# Altium project USRP2_Clone.PrjPcb (part 1 of 4)
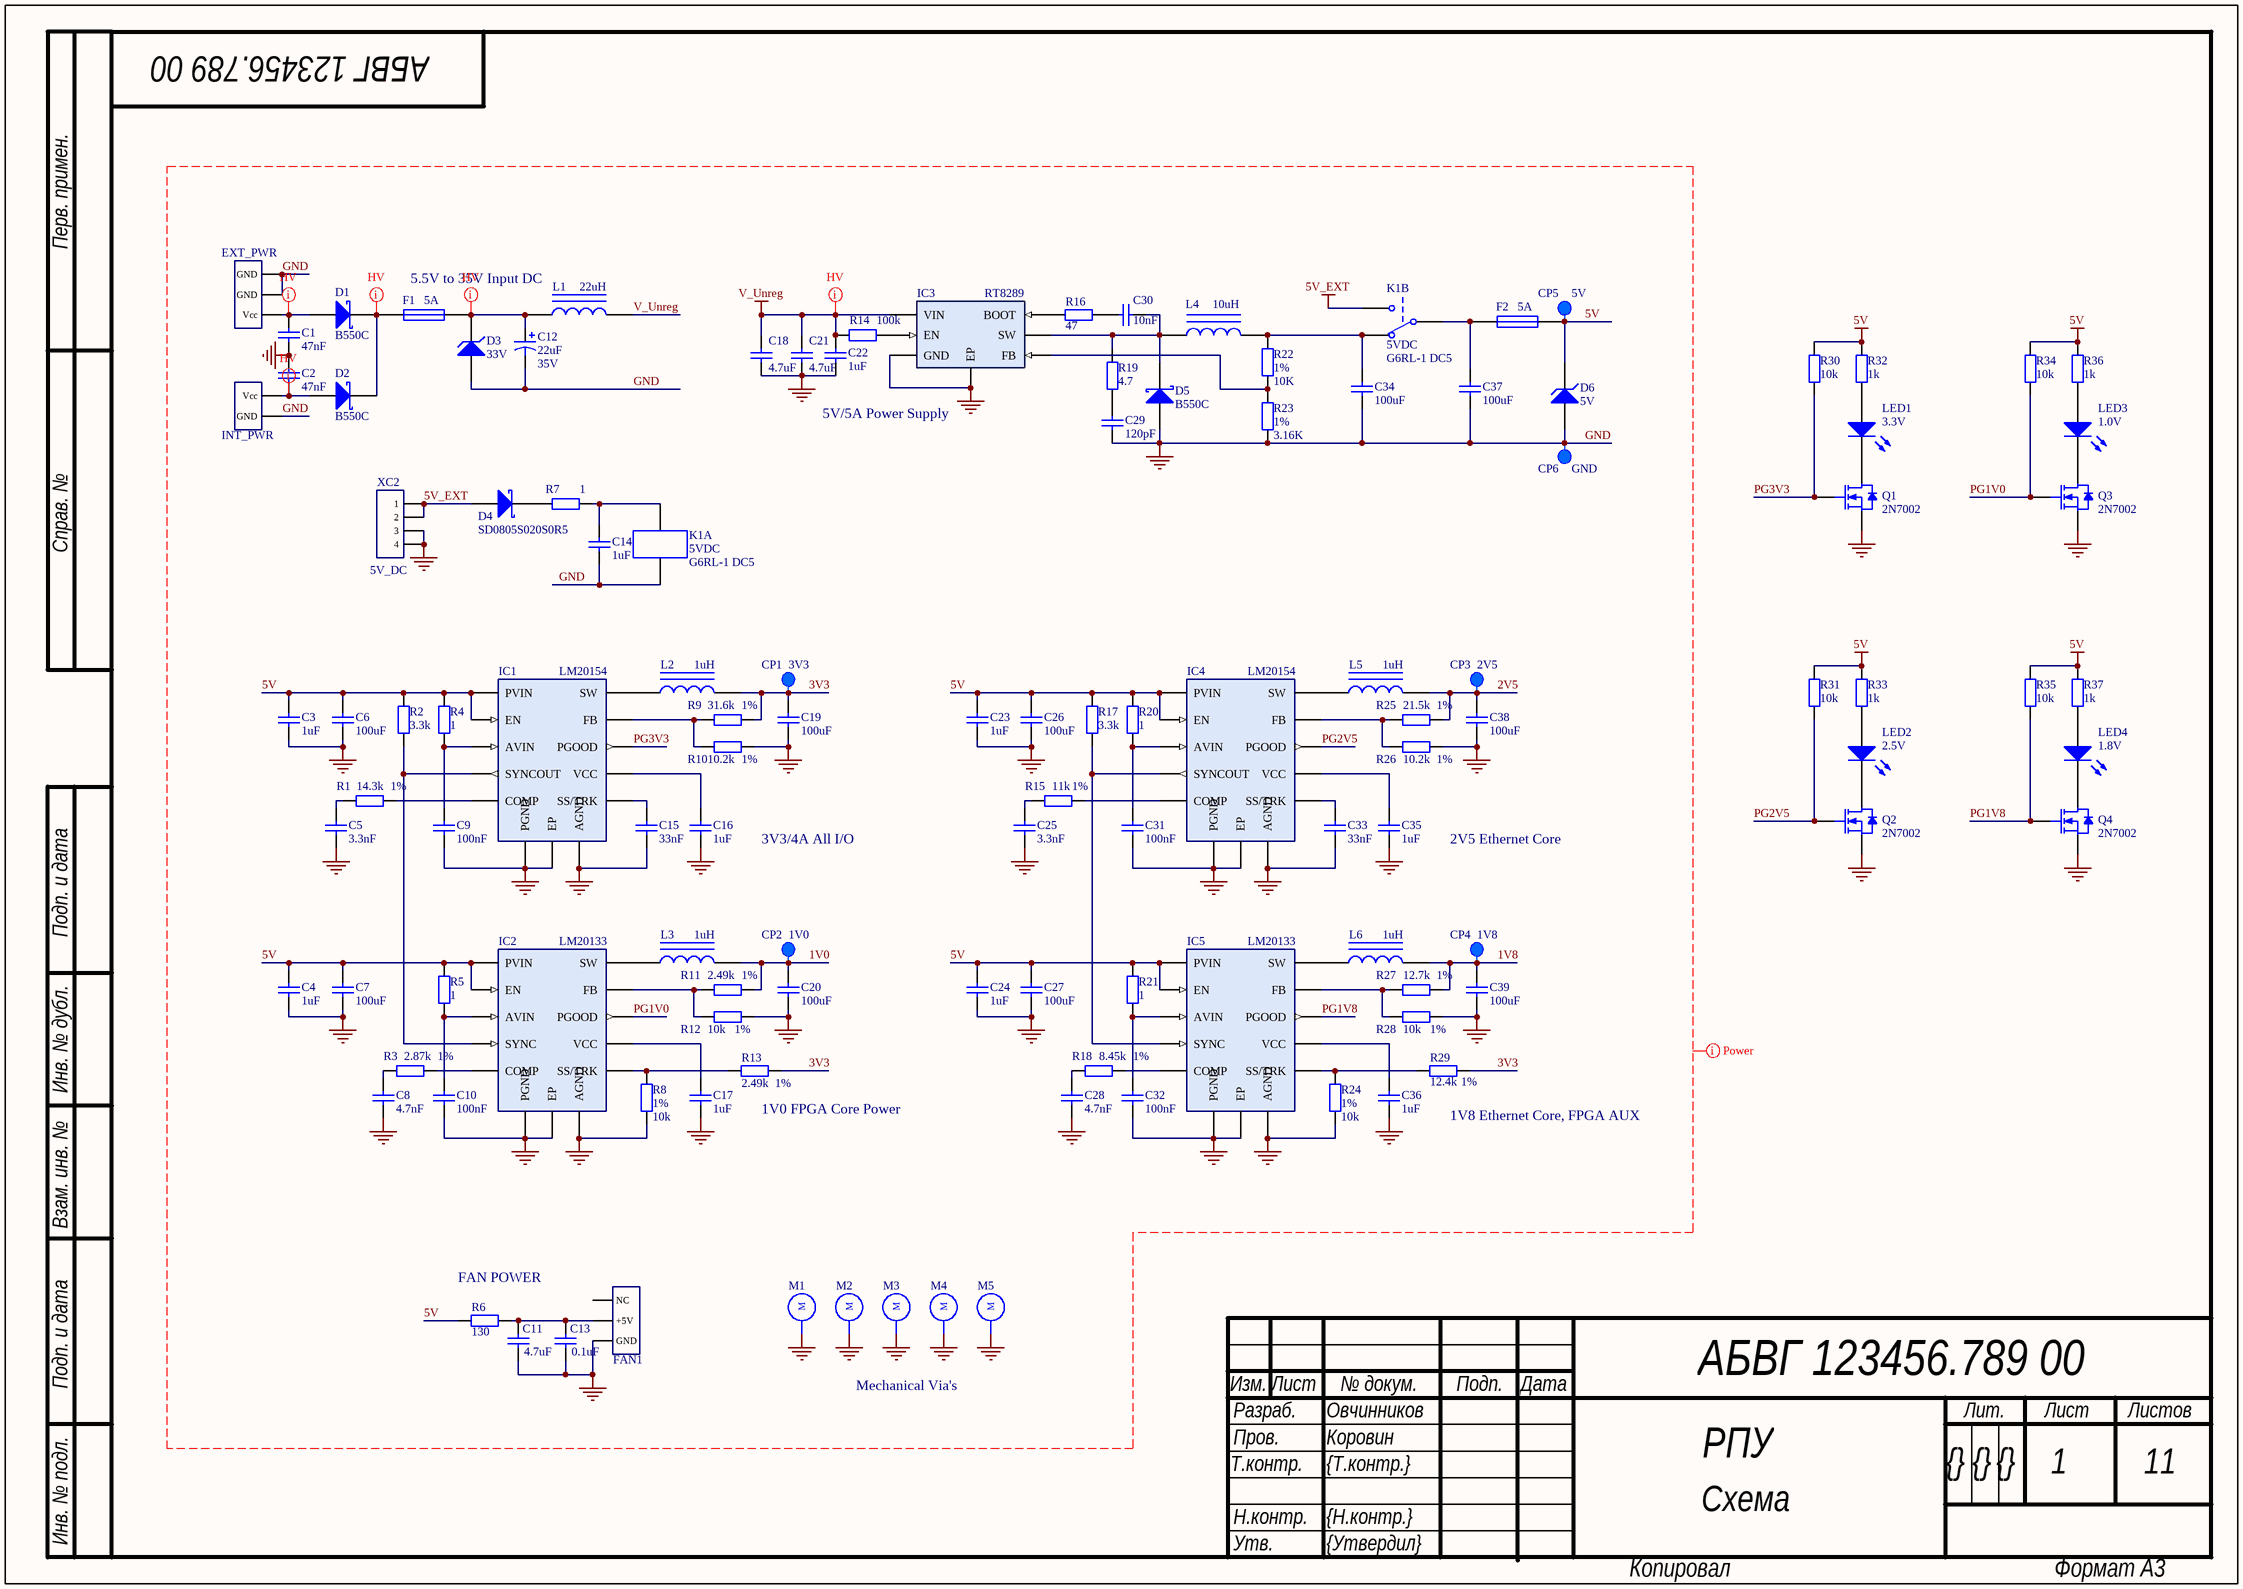
[diagram p0: Power_Supply.SchDoc]
11 sheets, 819 parts. Net scope: global (net labels, ports and power ports of the same name join across sheets).
Board file: MotherBoard.PcbDoc
Sheets:
  Power_Supply.SchDoc
  MGT_PWR.SchDoc
  FPGA_Power.SchDoc
  Ethernet.SchDoc
  JTAG.SchDoc
  Clocking.SchDoc
  DB.SchDoc
  FPGA&CODECS.SchDoc
  RAM&GPIO.SchDoc
  FSP+.SchDoc
  DDR2.SchDoc

## Sheet Power_Supply.SchDoc: РПУ
size 420 x 297 mm; ApprovedBy: {Утвердил}; CheckedBy: Коровин; DrawnBy: Овчинников; DocumentNumber: АБВГ 123456.789 00; SheetNumber: 1; SheetTotal: 11; Scale: {Мш.}; PageSetup: Record=PageOptions|CenterHorizontal=False|CenterVertical=False|PrintScale=0.95|XCorrection=0.00|YCorrection=0.00|PrintKind=1|BorderSize=5000000|LeftOffset=0|BottomOffset=0|Orientation=1|PaperLength=1000|PaperWidth=1000|Scale=100|PaperSource=15|PrintQuality=600|MediaType=1|DitherType=10|PaperKind=A4|PrintScaleMode=1; ProcessInspection: {Т.контр.}; Mass: {М.}; NormInspection: {Н.контр.}; Letter1Column: {}; Letter2Column: {}; Letter3Column: {}; DocumentType: Схема; Rule: PcbType=ProtelPcb

### Parts
C1  value 47nF  [C0805]  (hidden comment: Cap)
C2  value 47nF  [C0805]  (hidden comment: Cap)
C3  value 1uF  [C0805]  (hidden comment: Cap)
C4  value 1uF  [C0805]  (hidden comment: Cap)
C5  value 3.3nF  [C0603]  (hidden comment: Cap)
C6  value 100uF  [C1210]  (hidden comment: Cap)
C7  value 100uF  [C1210]  (hidden comment: Cap)
C8  value 4.7nF  [C0603]  (hidden comment: Cap)
C9  value 100nF  [C0603]  (hidden comment: Cap)
C10  value 100nF  [C0603]  (hidden comment: Cap)
C11  value 4.7uF  [C0805]  (hidden comment: Cap)
C12  value 22uF  Voltage: 35V  [Tantalum_D]  (hidden comment: Tantalum Cap)
C13  value 0.1uF  [C0805]  (hidden comment: Cap)
C14  value 1uF  [C0805]  (hidden comment: Cap)
C15  value 33nF  [C0603]  (hidden comment: Cap)
C16  value 1uF  [C0603]  (hidden comment: Cap)
C17  value 1uF  [C0603]  (hidden comment: Cap)
C18  value 4.7uF  [C1206]  (hidden comment: Cap)
C19  value 100uF  [C1210]  (hidden comment: Cap)
C20  value 100uF  [C1210]  (hidden comment: Cap)
C21  value 4.7uF  [C1206]  (hidden comment: Cap)
C22  value 1uF  [C1206]  (hidden comment: Cap)
C23  value 1uF  [C0805]  (hidden comment: Cap)
C24  value 1uF  [C0805]  (hidden comment: Cap)
C25  value 3.3nF  [C0603]  (hidden comment: Cap)
C26  value 100uF  [C1210]  (hidden comment: Cap)
C27  value 100uF  [C1210]  (hidden comment: Cap)
C28  value 4.7nF  [C0603]  (hidden comment: Cap)
C29  value 120pF  [C0805]  (hidden comment: Cap)
C30  value 10nF  [C0805]  (hidden comment: Cap)
C31  value 100nF  [C0603]  (hidden comment: Cap)
C32  value 100nF  [C0603]  (hidden comment: Cap)
C33  value 33nF  [C0603]  (hidden comment: Cap)
C34  value 100uF  [C1210]  (hidden comment: Cap)
C35  value 1uF  [C0603]  (hidden comment: Cap)
C36  value 1uF  [C0603]  (hidden comment: Cap)
C37  value 100uF  [C1210]  (hidden comment: Cap)
C38  value 100uF  [C1210]  (hidden comment: Cap)
C39  value 100uF  [C1210]  (hidden comment: Cap)
CP1  3V3  [Control Point]
CP2  1V0  [Control Point]
CP3  2V5  [Control Point]
CP4  1V8  [Control Point]
CP5  5V  [Control Point]
CP6  GND  [Control Point]
D1  B550C  [Diode_SMC]
D2  B550C  [Diode_SMC]
D3  Voltage: 33V  [SMF]  (hidden comment: Supressor)
D4  Name: SD0805S020S0R5  [SD0805]  (hidden comment: D Schottky)
D5  B550C  [Diode_SMC]
D6  Voltage: 5V  [SMF]  (hidden comment: Supressor)
DC_PWR1  EXT_PWR  [DC_CONNECTOR]
F1  Current: 5A  [Fuse]  (hidden comment: Fuse)
F2  Current: 5A  [Fuse]  (hidden comment: Fuse)
FAN1  FAN  [FAN_HDR]  (value not drawn)
IC1  LM20154  [LM201xx]
IC2  LM20133  [LM201xx]
IC3  RT8289  [RT8289]
IC4  LM20154  [LM201xx]
IC5  LM20133  [LM201xx]
K1  5VDC  Name: G6RL-1 DC5  [G6RL]  (parts A,B of 2)
L1  value 22uH  [XAL6060-223]  (hidden comment: Inductor Power)
L2  value 1uH  [Coilcraft MSS1038]  (hidden comment: Inductor Power)
L3  value 1uH  [Coilcraft MSS1038]  (hidden comment: Inductor Power)
L4  value 10uH  [Coilcraft MSS1048]  (hidden comment: Inductor Power)
L5  value 1uH  [Coilcraft MSS1038]  (hidden comment: Inductor Power)
L6  value 1uH  [Coilcraft MSS1038]  (hidden comment: Inductor Power)
LED1  3.3V  [LED_0402_Blue]
LED2  2.5V  [LED_0402_Blue]
LED3  1.0V  [LED_0402_Blue]
LED4  1.8V  [LED_0402_Blue]
M1  Via  [Mechanical_Via]  (value not drawn)
M2  Via  [Mechanical_Via]  (value not drawn)
M3  Via  [Mechanical_Via]  (value not drawn)
M4  Via  [Mechanical_Via]  (value not drawn)
M5  Via  [Mechanical_Via]  (value not drawn)
Q1  2N7002  [SOT-23]
Q2  2N7002  [SOT-23]
Q3  2N7002  [SOT-23]
Q4  2N7002  [SOT-23]
R1  value 14.3k  Tolerance: 1%  [R0603]  (hidden comment: Res)
R2  value 3.3k  [R0603]  (hidden comment: Res)
R3  value 2.87k  Tolerance: 1%  [R0603]  (hidden comment: Res)
R4  value 1  [R0603]  (hidden comment: Res)
R5  value 1  [R0603]  (hidden comment: Res)
R6  value 130  [R0805]  (hidden comment: Res)
R7  value 1  [R0805]  (hidden comment: Res)
R8  value 10k  Tolerance: 1%  [R0603]  (hidden comment: Res)
R9  value 31.6k  Tolerance: 1%  [R0603]  (hidden comment: Res)
R10  value 10.2k  Tolerance: 1%  [R0603]  (hidden comment: Res)
R11  value 2.49k  Tolerance: 1%  [R0603]  (hidden comment: Res)
R12  value 10k  Tolerance: 1%  [R0603]  (hidden comment: Res)
R13  value 2.49k  Tolerance: 1%  [R0603]  (hidden comment: Res)
R14  value 100k  [R0805]  (hidden comment: Res)
R15  value 11k  Tolerance: 1%  [R0603]  (hidden comment: Res)
R16  value 47  [R0805]  (hidden comment: Res)
R17  value 3.3k  [R0603]  (hidden comment: Res)
R18  value 8.45k  Tolerance: 1%  [R0603]  (hidden comment: Res)
R19  value 4.7  [R0805]  (hidden comment: Res)
R20  value 1  [R0603]  (hidden comment: Res)
R21  value 1  [R0603]  (hidden comment: Res)
R22  value 10K  Tolerance: 1%  [R0805]  (hidden comment: Res)
R23  value 3.16K  Tolerance: 1%  [R0805]  (hidden comment: Res)
R24  value 10k  Tolerance: 1%  [R0603]  (hidden comment: Res)
R25  value 21.5k  Tolerance: 1%  [R0603]  (hidden comment: Res)
R26  value 10.2k  Tolerance: 1%  [R0603]  (hidden comment: Res)
R27  value 12.7k  Tolerance: 1%  [R0603]  (hidden comment: Res)
R28  value 10k  Tolerance: 1%  [R0603]  (hidden comment: Res)
R29  value 12.4k  Tolerance: 1%  [R0603]  (hidden comment: Res)
R30  value 10k  [R0402]  (hidden comment: Res)
R31  value 10k  [R0402]  (hidden comment: Res)
R32  value 1k  [R0402]  (hidden comment: Res)
R33  value 1k  [R0402]  (hidden comment: Res)
R34  value 10k  [R0402]  (hidden comment: Res)
R35  value 10k  [R0402]  (hidden comment: Res)
R36  value 1k  [R0402]  (hidden comment: Res)
R37  value 1k  [R0402]  (hidden comment: Res)
XC1  INT_PWR  [2x2 PWR_HDR]
XC2  5V_DC  [H-DAC 64]

### Nets
1V0: C20.1 CP2.1 L3.2 R11.1
1V8: C39.2 CP4.1 L6.2 R27.1
2V5: C38.2 CP3.1 L5.2 R25.1
3V3: C19.1 CP1.1 L2.2 R9.1 R13.1 R29.1
5V: C3.1 C4.1 C6.1 C7.1 C23.1 C24.2 C26.1 C27.1 CP5.1 D6.1(K) F2.1 IC1.6(PVIN) IC1.12(EN) IC2.6(PVIN) IC2.12(EN) IC4.6(PVIN) IC4.12(EN) IC5.6(PVIN) IC5.12(EN) R2.2 R4.1 R5.1 R6.2 R17.1 R20.1 R21.1 R30.2 R31.2 R32.2 R33.2 R34.2 R35.2 R36.2 R37.2
5V_EXT: D4.2(A) K1.3 XC2.1 XC2.2
GND: C1.1 C2.2 C3.2 C4.2 C5.2 C6.2 C7.2 C8.2 C9.1 C10.2 C11.2 C12.2 C13.2 C14.2 C15.1 C16.1 C17.1 C18.2 C19.2 C20.2 C21.2 C22.2 C23.2 C24.1 C25.2 C26.2 C27.2 C28.2 C29.1 C31.2 C32.2 C33.2 C34.2 C35.1 C36.1 C37.1 C38.1 C39.1 CP6.1 D3.2(A) D5.2(A) D6.2(A) DC_PWR1.2(GND) DC_PWR1.3(GND) FAN1.1(GND) IC1.10(PGND) IC1.15(AGND) IC1.17(EP) IC2.10(PGND) IC2.15(AGND) IC2.17(EP) IC3.6(GND) IC3.9(EP) IC4.10(PGND) IC4.15(AGND) IC4.17(EP) IC5.10(PGND) IC5.15(AGND) IC5.17(EP) K1.1 M1.0(M) M2.0(M) M3.0(M) M4.0(M) M5.0(M) Q1.2(S) Q2.2(S) Q3.2(S) Q4.2(S) R8.1 R10.2 R12.2 R23.1 R24.1 R26.2 R28.2 XC1.1(GND) XC2.3 XC2.4
V_Unreg: C18.1 C21.1 C22.1 IC3.7(VIN) L1.2 R14.2
PG1V0: IC2.3(PGOOD) Q3.1(G) R34.1
PG1V8: IC5.3(PGOOD) Q4.1(G) R35.1
PG2V5: IC4.3(PGOOD) Q2.1(G) R31.1
PG3V3: IC1.3(PGOOD) Q1.1(G) R30.1
NetC1_2: C1.2 D1.2(A) DC_PWR1.1(Vcc)
NetC2_1: C2.1 D2.2(A) XC1.2(Vcc)
NetC5_1: C5.1 R1.1
NetC8_1: C8.1 R3.1
NetC9_2: C9.2 IC1.14(AVIN) R4.2
NetC10_1: C10.1 IC2.14(AVIN) R5.2
NetC11_1: C11.1 C13.1 FAN1.2(+5V) R6.1
NetC12_1: C12.1 D3.1(K) F1.2 L1.1
NetC14_1: C14.1 K1.5 R7.1
NetC15_2: C15.2 IC1.1(SS/TRK)
NetC16_2: C16.2 IC1.13(VCC)
NetC17_2: C17.2 IC2.13(VCC)
NetC25_1: C25.1 R15.1
NetC28_1: C28.1 R18.1
NetC29_2: C29.2 R19.2
NetC30_1: C30.1 R16.2
NetC30_2: C30.2 D5.1(K) IC3.8(SW) L4.1 R19.1
NetC31_1: C31.1 IC4.14(AVIN) R20.2
NetC32_1: C32.1 IC5.14(AVIN) R21.2
NetC33_1: C33.1 IC4.1(SS/TRK)
NetC34_1: C34.1 K1.4 L4.2 R22.2
NetC35_2: C35.2 IC4.13(VCC)
NetC36_2: C36.2 IC5.13(VCC)
NetC37_2: C37.2 F2.2 K1.2
NetD1_1: D1.1(K) D2.1(K) F1.1
NetD4_1: D4.1(K) R7.2
NetIC1_2: IC1.2(FB) R9.2 R10.1
NetIC1_4: IC1.4(COMP) R1.2
NetIC1_8: IC1.8(SW) L2.1
NetIC1_16: IC1.16(SYNCOUT) IC2.16(SYNC) R2.1
NetIC2_1: IC2.1(SS/TRK) R8.2 R13.2
NetIC2_2: IC2.2(FB) R11.2 R12.1
NetIC2_4: IC2.4(COMP) R3.2
NetIC2_8: IC2.8(SW) L3.1
NetIC3_1: IC3.1(BOOT) R16.1
NetIC3_4: IC3.4(FB) R22.1 R23.2
NetIC3_5: IC3.5(EN) R14.1
NetIC4_2: IC4.2(FB) R25.2 R26.1
NetIC4_4: IC4.4(COMP) R15.2
NetIC4_8: IC4.8(SW) L5.1
NetIC4_16: IC4.16(SYNCOUT) IC5.16(SYNC) R17.2
NetIC5_1: IC5.1(SS/TRK) R24.2 R29.2
NetIC5_2: IC5.2(FB) R27.2 R28.1
NetIC5_4: IC5.4(COMP) R18.2
NetIC5_8: IC5.8(SW) L6.1
NetLED1_1: LED1.1(K) Q1.3(D)
NetLED1_2: LED1.2(A) R32.1
NetLED2_1: LED2.1(K) Q2.3(D)
NetLED2_2: LED2.2(A) R33.1
NetLED3_1: LED3.1(K) Q3.3(D)
NetLED3_2: LED3.2(A) R36.1
NetLED4_1: LED4.1(K) Q4.3(D)
NetLED4_2: LED4.2(A) R37.1

Not connected (* = marked no-connect by the designer): FAN1 3(NC)

### Layout directives
net class Power: 1V0, 1V8, 2V5, 3V3, 5V, 5V_EXT, GND, PG1V0, PG1V8, PG2V5, PG3V3, V_Unreg
net class HV: NetC1_2, NetC2_1, NetC12_1, NetD1_1, V_Unreg

### Notes on the sheet
- 5.5V to 35V Input DC
- 5V/5A Power Supply
- 3V3/4A All I/O
- 2V5 Ethernet Core
- (near R13) 1V0 FPGA Core Power
- (near R29) 1V8 Ethernet Core, FPGA AUX
- FAN POWER
- Mechanical Via's
- Перв. примен.
- Справ. №
- Подп. и дата
- Инв. № дубл.
- Взам. инв. №
- Изм.
- Лист
- № докум.
- Подп.
- Дата
- Т.контр.
- Пров.
- Разраб.
- Лит.
- Листов
- Инв. № подл.
- Н.контр.
- Утв.
- Копировал
- Формат А3

### Library data of the parts
C1 C2 C18 C21 C22 C29 C30 = Cer Cap: Cer Cap Small; Manufacturer: Murata; Material: x7r; Voltage: 50V; Tolerance: 10%; Type: Ceramic; PackageReference: SMD Chip Capacitor
  C1 C2 C29 C30: Package: 0805
  C18 C21 C22: Package: 1206
C3 C4 C11 C13 C23 C24 = Cer Cap: Cer Cap Small; Manufacturer: Murata; Material: x5r; Voltage: 16V; Tolerance: 10%; Type: Ceramic; PackageReference: SMD Chip Capacitor; Package: 0805
C5 C8 C25 C28 = Cer Cap: Cer Cap Small; Manufacturer: Murata; Material: x5r; Voltage: 25V; Tolerance: 10%; Type: Ceramic; PackageReference: SMD Chip Capacitor; Package: 0603
C6 C7 C19 C20 C26 C27 C34 C37-C39 = Cap uF: Cer Cap Large; Manufacturer: Murata; Material: x5r; Tolerance: 20%; Voltage: 6.3V; Type: Ceramic; Package: C1210; PackageDescription: SMD Chip Capacitor
C9 C10 C14 C31 C32 = Cer Cap: Cer Cap Small; Manufacturer: Murata; Material: x7r; Voltage: 16V; Tolerance: 10%; Type: Ceramic; PackageReference: SMD Chip Capacitor
  C9 C10 C31 C32: Package: 0603
  C14: Package: 0805
C12 = Tantalum Cap: Tantalum Polarity Cap; Manufacturer: Tecap; Name: Tantalum Capacitor; Tolerance: 20%; Type: Tantalum Polarity Cap; Temperature Range: -55…85; Package: Chip Capacitor Type D
C15 C33 = Cer Cap: Cer Cap Small; Manufacturer: Murata; Material: x7r; Voltage: 25V; Tolerance: 10%; Type: Ceramic; PackageReference: SMD Chip Capacitor; Package: 0603
C16 C17 C35 C36 = Cer Cap: Cer Cap Small; Manufacturer: Murata; Material: x5r; Voltage: 6.3V; Tolerance: 10%; Type: Ceramic; PackageReference: SMD Chip Capacitor; Package: 0603
CP1-CP6 = Control Point: Name: Control Point
D1 D2 D5 = B550C: Schottky Diode; Package: SMC; Name: B550C
D3 = Supressor: 33V Supressor; Name: SMF33A; Power: 200W; Package: SOD-123FL
D4 = D Schottky: Schottky Diode SMD; Manufacturer: AVX Corporation; Voltage: 20V; Current: 0.5A; Forward Voltage: 440mV@500mA; Type: Schottky Barrier Rectifier Diode; Package: SMD
D6 = Supressor: Name: SMF5.0A; Power: 200W; Package: SOT-123FL
DC_PWR1 = DC_Connector: DC Power Connector 6mm; Current: 5A; Voltage: 12V; Name: DC Power Connector; Type: 2.5mm*5.7mm; Package: through hole
F1 F2 = Fuse: Chip SMD Fuse; Name: Fast Fuse; Type: Fast Chip SMD Fuse; Voltage: 125V; Package: SMD Omni Block
FAN1 = FAN Connector: Current: 5A; Voltage: 12V; Name: FAN Connector; Package: through hole
IC1 IC4 = LM20154: Synchrous Buck Regulator; Current: 4A; Frequency: 1MHz; Input Voltage: 2.95V to 5.5V; Type: Synchrous Buck Regulator; Temperature Range: −40°C to + 125°C; Name: LM20154; Package: HTSSOP
IC2 IC5 = LM20133: Synchronous Buck Regulator; Input Voltage: 2.95V to 5.5V; Frequency: 500 kHz to 1.5 MHz; Current: 3A; Temperature Range: −40°C to + 125°C; Type: Synchronous Buck Regulator; Name: LM20133; Package: HTSSOP
IC3 = RT8289: Step-Down Converter; Current: 5A; Voltage: 32V; Frequency: 500 kHz; Name: RT8289; Package: SOP-8
K1 = Relay-SPDT_G6RL: Single-Pole Dual-Throw Relay; Manufacturer: Omron; Switch Current: 8A max; Type: Compact Single-pole Relay; Voltage: 5VDC
L1 = Inductor Power: Magnetic-Core Inductor; Manufacturer: Coilcraft; Tolerance: ±30%; Current: 5A; Package: XAL6060; Temperature Range: -40ºC to 125ºC; Name: XAL6060-223
L2 L3 L5 L6 = Inductor Power: Magnetic-Core Inductor; Manufacturer: Coilcraft; Tolerance: ±30%; Name: MSS1038; Current: 5A; Package: Chip Inductor; Temperature Range: -40ºC to 125ºC
L4 = Inductor Power: Magnetic-Core Inductor; Manufacturer: Coilcraft; Tolerance: ±30%; Name: MSS1048; Current: 5A; Package: 1048; Temperature Range: -40ºC to 125ºC
LED1-LED4 = LED: Typical RED, GREEN, YELLOW, AMBER GaAs LED; Manufacturer: Kingbright; Color: Blue; P/N: APHHS1005QBC/D; Package: 0402; Name: LED
M1-M5 = Mechanical_Via: Mechanical Via
Q1-Q4 = 2N7002: N-Channel MOSFET 2N7002; Current: 300mA; Voltage: 60V; Channel Resistance: 5Ohm; Power Dissipation: 0.83W; Name: 2N7002; Type: N-Channel MOSFET; Package: SOT-23
R1 R3 R8-R13 R15 R18 R22-R29 = Res: Resistor; Name: Chip SMD Resistor; Power: 0.062 Wt; Temperature Range: -55…155
  R1 R3 R8-R13 R15 R18 R24-R29: Package: 0603
  R22 R23: Package: 0805
R2 R4-R7 R14 R16 R17 R19-R21 R30-R37 = Res: Resistor; Name: Chip SMD Resistor; Tolerance: 5%; Power: 0.062 Wt; Temperature Range: -55…155
  R2 R4 R5 R17 R20 R21: Package: 0603
  R6 R7 R14 R16 R19: Package: 0805
  R30-R37: Package: 0402
XC1 = 1x2 Pwr_Hdr: Power Connector Mini-Fit; Name: Mini-Fit Power Connector; Current: 5A; Voltage: 12V; Type: 1x2; Package: Through Hole
XC2 = H-DAC PCB Connector: Manufacturer: Molex; Part Number: 0311010040; Name: PCB Header; Voltage: 500V; Current: 7.0 A; Mate With: H-DAC 64™ 31068 Series; Mate With P/N: 0310681010; Type: Vertical; Package: Through Hole; Series: H-DAC 64™ 31101; P/N: 0311010040

## Sheet MGT_PWR.SchDoc: {Наименование}
size 420 x 297 mm; DocumentNumber: ПЛАС.ХХХХХХ.ХХХ ХХ; SheetNumber: 2; SheetTotal: 11; PageSetup: Record=PageOptions|CenterHorizontal=False|CenterVertical=False|PrintScale=0.95|XCorrection=0.00|YCorrection=0.00|PrintKind=1|BorderSize=5000000|LeftOffset=0|BottomOffset=0|Orientation=1|PaperLength=1000|PaperWidth=1000|Scale=100|PaperSource=15|PrintQuality=600|MediaType=1|DitherType=10|PaperKind=A4|PrintScaleMode=1; Rule: PcbType=ProtelPcb
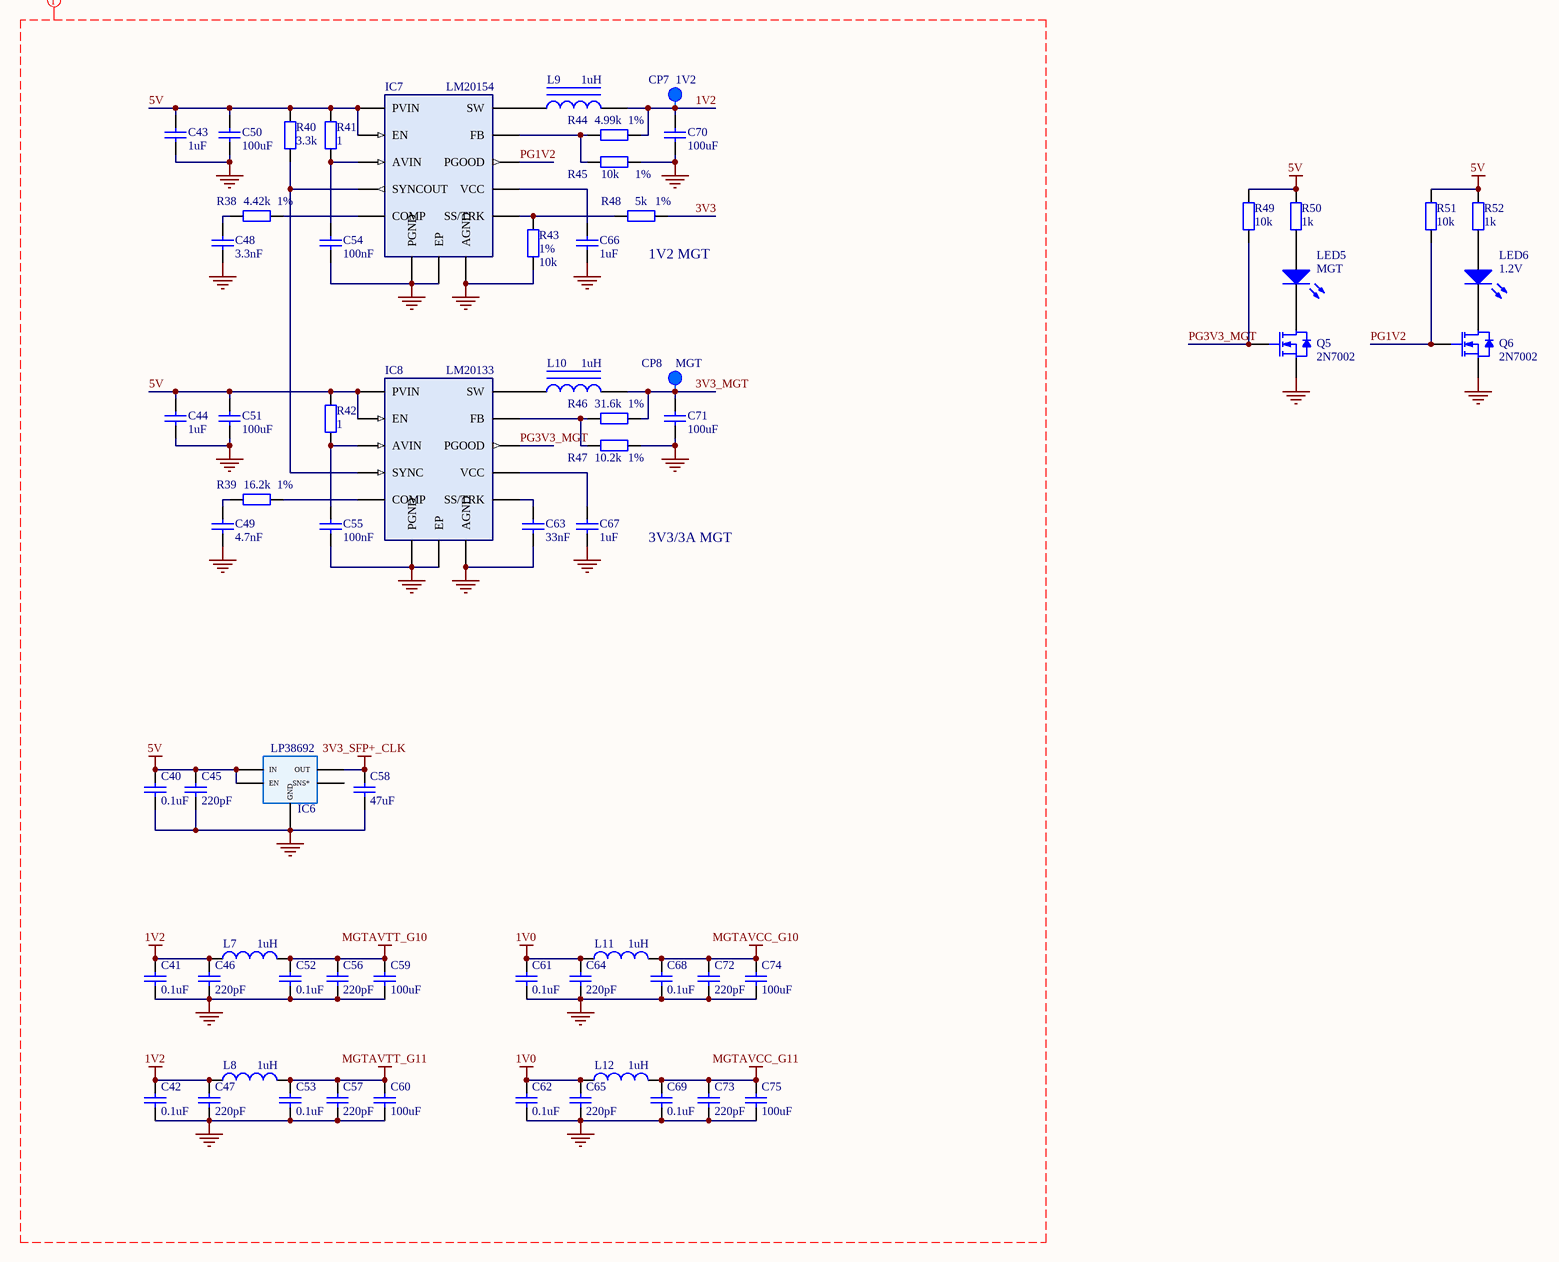
[diagram p1: MGT_PWR.SchDoc]

### Parts
C40  value 0.1uF  [C0603]  (hidden comment: Cap)
C41  value 0.1uF  [C0603]  (hidden comment: Cap)
C42  value 0.1uF  [C0603]  (hidden comment: Cap)
C43  value 1uF  [C0805]  (hidden comment: Cap)
C44  value 1uF  [C0805]  (hidden comment: Cap)
C45  value 220pF  [C0603]  (hidden comment: Cap)
C46  value 220pF  [C0603]  (hidden comment: Cap)
C47  value 220pF  [C0603]  (hidden comment: Cap)
C48  value 3.3nF  [C0603]  (hidden comment: Cap)
C49  value 4.7nF  [C0603]  (hidden comment: Cap)
C50  value 100uF  [C1210]  (hidden comment: Cap)
C51  value 100uF  [C1210]  (hidden comment: Cap)
C52  value 0.1uF  [C0603]  (hidden comment: Cap)
C53  value 0.1uF  [C0603]  (hidden comment: Cap)
C54  value 100nF  [C0603]  (hidden comment: Cap)
C55  value 100nF  [C0603]  (hidden comment: Cap)
C56  value 220pF  [C0603]  (hidden comment: Cap)
C57  value 220pF  [C0603]  (hidden comment: Cap)
C58  value 47uF  [C1210]  (hidden comment: Cap)
C59  value 100uF  [C1210]  (hidden comment: Cap)
C60  value 100uF  [C1210]  (hidden comment: Cap)
C61  value 0.1uF  [C0603]  (hidden comment: Cap)
C62  value 0.1uF  [C0603]  (hidden comment: Cap)
C63  value 33nF  [C0603]  (hidden comment: Cap)
C64  value 220pF  [C0603]  (hidden comment: Cap)
C65  value 220pF  [C0603]  (hidden comment: Cap)
C66  value 1uF  [C0603]  (hidden comment: Cap)
C67  value 1uF  [C0603]  (hidden comment: Cap)
C68  value 0.1uF  [C0603]  (hidden comment: Cap)
C69  value 0.1uF  [C0603]  (hidden comment: Cap)
C70  value 100uF  [C1210]  (hidden comment: Cap)
C71  value 100uF  [C1210]  (hidden comment: Cap)
C72  value 220pF  [C0603]  (hidden comment: Cap)
C73  value 220pF  [C0603]  (hidden comment: Cap)
C74  value 100uF  [C1210]  (hidden comment: Cap)
C75  value 100uF  [C1210]  (hidden comment: Cap)
CP7  1V2  [Control Point]
CP8  MGT  [Control Point]
IC6  LP38692  [SOT-223-5]
IC7  LM20154  [LM201xx]
IC8  LM20133  [LM201xx]
L7  value 1uH  [L1210_Murata LQH]  (hidden comment: Inductor_LF)
L8  value 1uH  [L1210_Murata LQH]  (hidden comment: Inductor_LF)
L9  value 1uH  [Coilcraft MSS1038]  (hidden comment: Inductor Power)
L10  value 1uH  [Coilcraft MSS1038]  (hidden comment: Inductor Power)
L11  value 1uH  [L1210_Murata LQH]  (hidden comment: Inductor_LF)
L12  value 1uH  [L1210_Murata LQH]  (hidden comment: Inductor_LF)
LED5  MGT  [LED_0402_Blue]
LED6  1.2V  [LED_0402_Blue]
Q5  2N7002  [SOT-23]
Q6  2N7002  [SOT-23]
R38  value 4.42k  Tolerance: 1%  [R0603]  (hidden comment: Res)
R39  value 16.2k  Tolerance: 1%  [R0603]  (hidden comment: Res)
R40  value 3.3k  [R0603]  (hidden comment: Res)
R41  value 1  [R0603]  (hidden comment: Res)
R42  value 1  [R0603]  (hidden comment: Res)
R43  value 10k  Tolerance: 1%  [R0603]  (hidden comment: Res)
R44  value 4.99k  Tolerance: 1%  [R0603]  (hidden comment: Res)
R45  value 10k  Tolerance: 1%  [R0603]  (hidden comment: Res)
R46  value 31.6k  Tolerance: 1%  [R0603]  (hidden comment: Res)
R47  value 10.2k  Tolerance: 1%  [R0603]  (hidden comment: Res)
R48  value 5k  Tolerance: 1%  [R0603]  (hidden comment: Res)
R49  value 10k  [R0402]  (hidden comment: Res)
R50  value 1k  [R0402]  (hidden comment: Res)
R51  value 10k  [R0402]  (hidden comment: Res)
R52  value 1k  [R0402]  (hidden comment: Res)

### Nets
1V0: C61.2 C62.2 C64.2 C65.1 L11.2 L12.2
1V2: C41.1 C42.1 C46.1 C47.1 C70.2 CP7.1 L7.2 L8.2 L9.2 R44.1
3V3: R48.1
3V3_MGT: C71.2 CP8.1 L10.2 R46.1
3V3_SFP+_CLK: C58.1 IC6.3(OUT)
5V: C40.1 C43.1 C44.1 C45.1 C50.1 C51.1 IC6.1(EN) IC6.4(IN) IC7.6(PVIN) IC7.12(EN) IC8.6(PVIN) IC8.12(EN) R40.2 R41.1 R42.2 R49.2 R50.2 R51.2 R52.2
GND: C40.2 C41.2 C42.2 C43.2 C44.2 C45.2 C46.2 C47.2 C48.1 C49.1 C50.2 C51.2 C52.2 C53.2 C54.2 C55.2 C56.2 C57.2 C58.2 C59.2 C60.2 C61.1 C62.1 C63.2 C64.1 C65.2 C66.2 C67.1 C68.2 C69.2 C70.1 C71.1 C72.2 C73.2 C74.2 C75.2 IC6.5(GND) IC7.10(PGND) IC7.15(AGND) IC7.17(EP) IC8.10(PGND) IC8.15(AGND) IC8.17(EP) Q5.2(S) Q6.2(S) R43.2 R45.2 R47.2
MGTAVCC_G10: C68.1 C72.1 C74.1 L11.1
MGTAVCC_G11: C69.1 C73.1 C75.1 L12.1
MGTAVTT_G10: C52.1 C56.1 C59.1 L7.1
MGTAVTT_G11: C53.1 C57.1 C60.1 L8.1
PG1V2: IC7.3(PGOOD) Q6.1(G) R51.1
PG3V3_MGT: IC8.3(PGOOD) Q5.1(G) R49.1
NetC48_2: C48.2 R38.1
NetC49_2: C49.2 R39.2
NetC54_1: C54.1 IC7.14(AVIN) R41.2
NetC55_1: C55.1 IC8.14(AVIN) R42.1
NetC63_1: C63.1 IC8.1(SS/TRK)
NetC66_1: C66.1 IC7.13(VCC)
NetC67_2: C67.2 IC8.13(VCC)
NetIC7_1: IC7.1(SS/TRK) R43.1 R48.2
NetIC7_2: IC7.2(FB) R44.2 R45.1
NetIC7_4: IC7.4(COMP) R38.2
NetIC7_8: IC7.8(SW) L9.1
NetIC7_16: IC7.16(SYNCOUT) IC8.16(SYNC) R40.1
NetIC8_2: IC8.2(FB) R46.2 R47.1
NetIC8_4: IC8.4(COMP) R39.1
NetIC8_8: IC8.8(SW) L10.1
NetLED5_1: LED5.1(K) Q5.3(D)
NetLED5_2: LED5.2(A) R50.1
NetLED6_1: LED6.1(K) Q6.3(D)
NetLED6_2: LED6.2(A) R52.1

Not connected (* = marked no-connect by the designer): IC6 6(SNS*)

### Layout directives
net class Power: 1V0, 1V2, 3V3, 3V3_MGT, 3V3_SFP+_CLK, 5V, GND, MGTAVCC_G10, MGTAVCC_G11, MGTAVTT_G10, MGTAVTT_G11, PG1V2, PG3V3_MGT

### Notes on the sheet
- (near R48) 1V2 MGT
- 3V3/3A MGT
- Подп. и дата
- Инв. № дубл.
- Взам. инв. №
- Инв. № подл.
- Лист
- Изм.
- № докум.
- Подп.
- Дата
- Копировал
- Формат А3

### Library data of the parts
C40-C47 C52 C53 C56 C57 C61 C62 C64 C65 C68 C69 C72 C73 = Cer Cap: as C3 on sheet Power_Supply; PackageReference: SMD Chip Capacitor
  C40-C42 C45-C47 C52 C53 C56 C57 C61 C62 C64 C65 C68 C69 C72 C73: Package: 0603
  C43 C44: Package: 0805
C48 C49 = Cer Cap: as C5 on sheet Power_Supply; PackageReference: SMD Chip Capacitor; Package: 0603
C50 C51 C58-C60 C70 C71 C74 C75 = Cap uF: as C6 on sheet Power_Supply; Package: C1210; PackageDescription: SMD Chip Capacitor
C54 C55 = Cer Cap: as C9 on sheet Power_Supply; PackageReference: SMD Chip Capacitor; Package: 0603
C63 = Cer Cap: as C15 on sheet Power_Supply; PackageReference: SMD Chip Capacitor; Package: 0603
C66 C67 = Cer Cap: as C16 on sheet Power_Supply; PackageReference: SMD Chip Capacitor; Package: 0603
CP7 CP8 = Control Point: Name: Control Point
IC6 = LP38692: Linear Regulator; Name: LP28692MP-3.3; Input Voltage: 2.7 V to 10 V; Output Accuracy: 2.5%; Dropout Voltage: 450 mV at 1 A; Package: SOT-223-5; Type: Linear Regulator; Temperature Range: –40°C to 125°C
IC7 = LM20154: as IC1 on sheet Power_Supply; Type: Synchrous Buck Regulator; Temperature Range: −40°C to + 125°C; Name: LM20154; Package: HTSSOP
IC8 = LM20133: as IC2 on sheet Power_Supply; Temperature Range: −40°C to + 125°C; Type: Synchronous Buck Regulator; Name: LM20133; Package: HTSSOP
L7 L8 L11 L12 = Inductor_LF: Inductor_Power_Lines; Manufacturer: Murata; Name: LQH32PN1R0NNC; Tolerance: 5%; Current: 2500mA; Frequency: 100MHz; Package: 1210; PackageDescription: Chip Inductor; Temperature Range: -25…85; Series: LQH
L9 L10 = Inductor Power: as L2 on sheet Power_Supply; Package: Chip Inductor; Temperature Range: -40ºC to 125ºC
LED5 LED6 = LED: as LED1 on sheet Power_Supply; Package: 0402; Name: LED
Q5 Q6 = 2N7002: as Q1 on sheet Power_Supply; Name: 2N7002; Type: N-Channel MOSFET; Package: SOT-23
R38 R39 R43-R48 = Res: as R1 on sheet Power_Supply; Package: 0603; Temperature Range: -55…155
R40-R42 R49-R52 = Res: as R2 on sheet Power_Supply; Temperature Range: -55…155
  R40-R42: Package: 0603
  R49-R52: Package: 0402

## Sheet FPGA_Power.SchDoc: {Наименование}
size 420 x 297 mm; DocumentNumber: ПЛАС.ХХХХХХ.ХХХ ХХ; SheetNumber: 3; SheetTotal: 11; PageSetup: Record=PageOptions|CenterHorizontal=False|CenterVertical=False|PrintScale=0.95|XCorrection=0.00|YCorrection=0.00|PrintKind=1|BorderSize=5000000|LeftOffset=0|BottomOffset=0|Orientation=1|PaperLength=1000|PaperWidth=1000|Scale=100|PaperSource=15|PrintQuality=600|MediaType=1|DitherType=10|PaperKind=A4|PrintScaleMode=1; Rule: PcbType=ProtelPcb
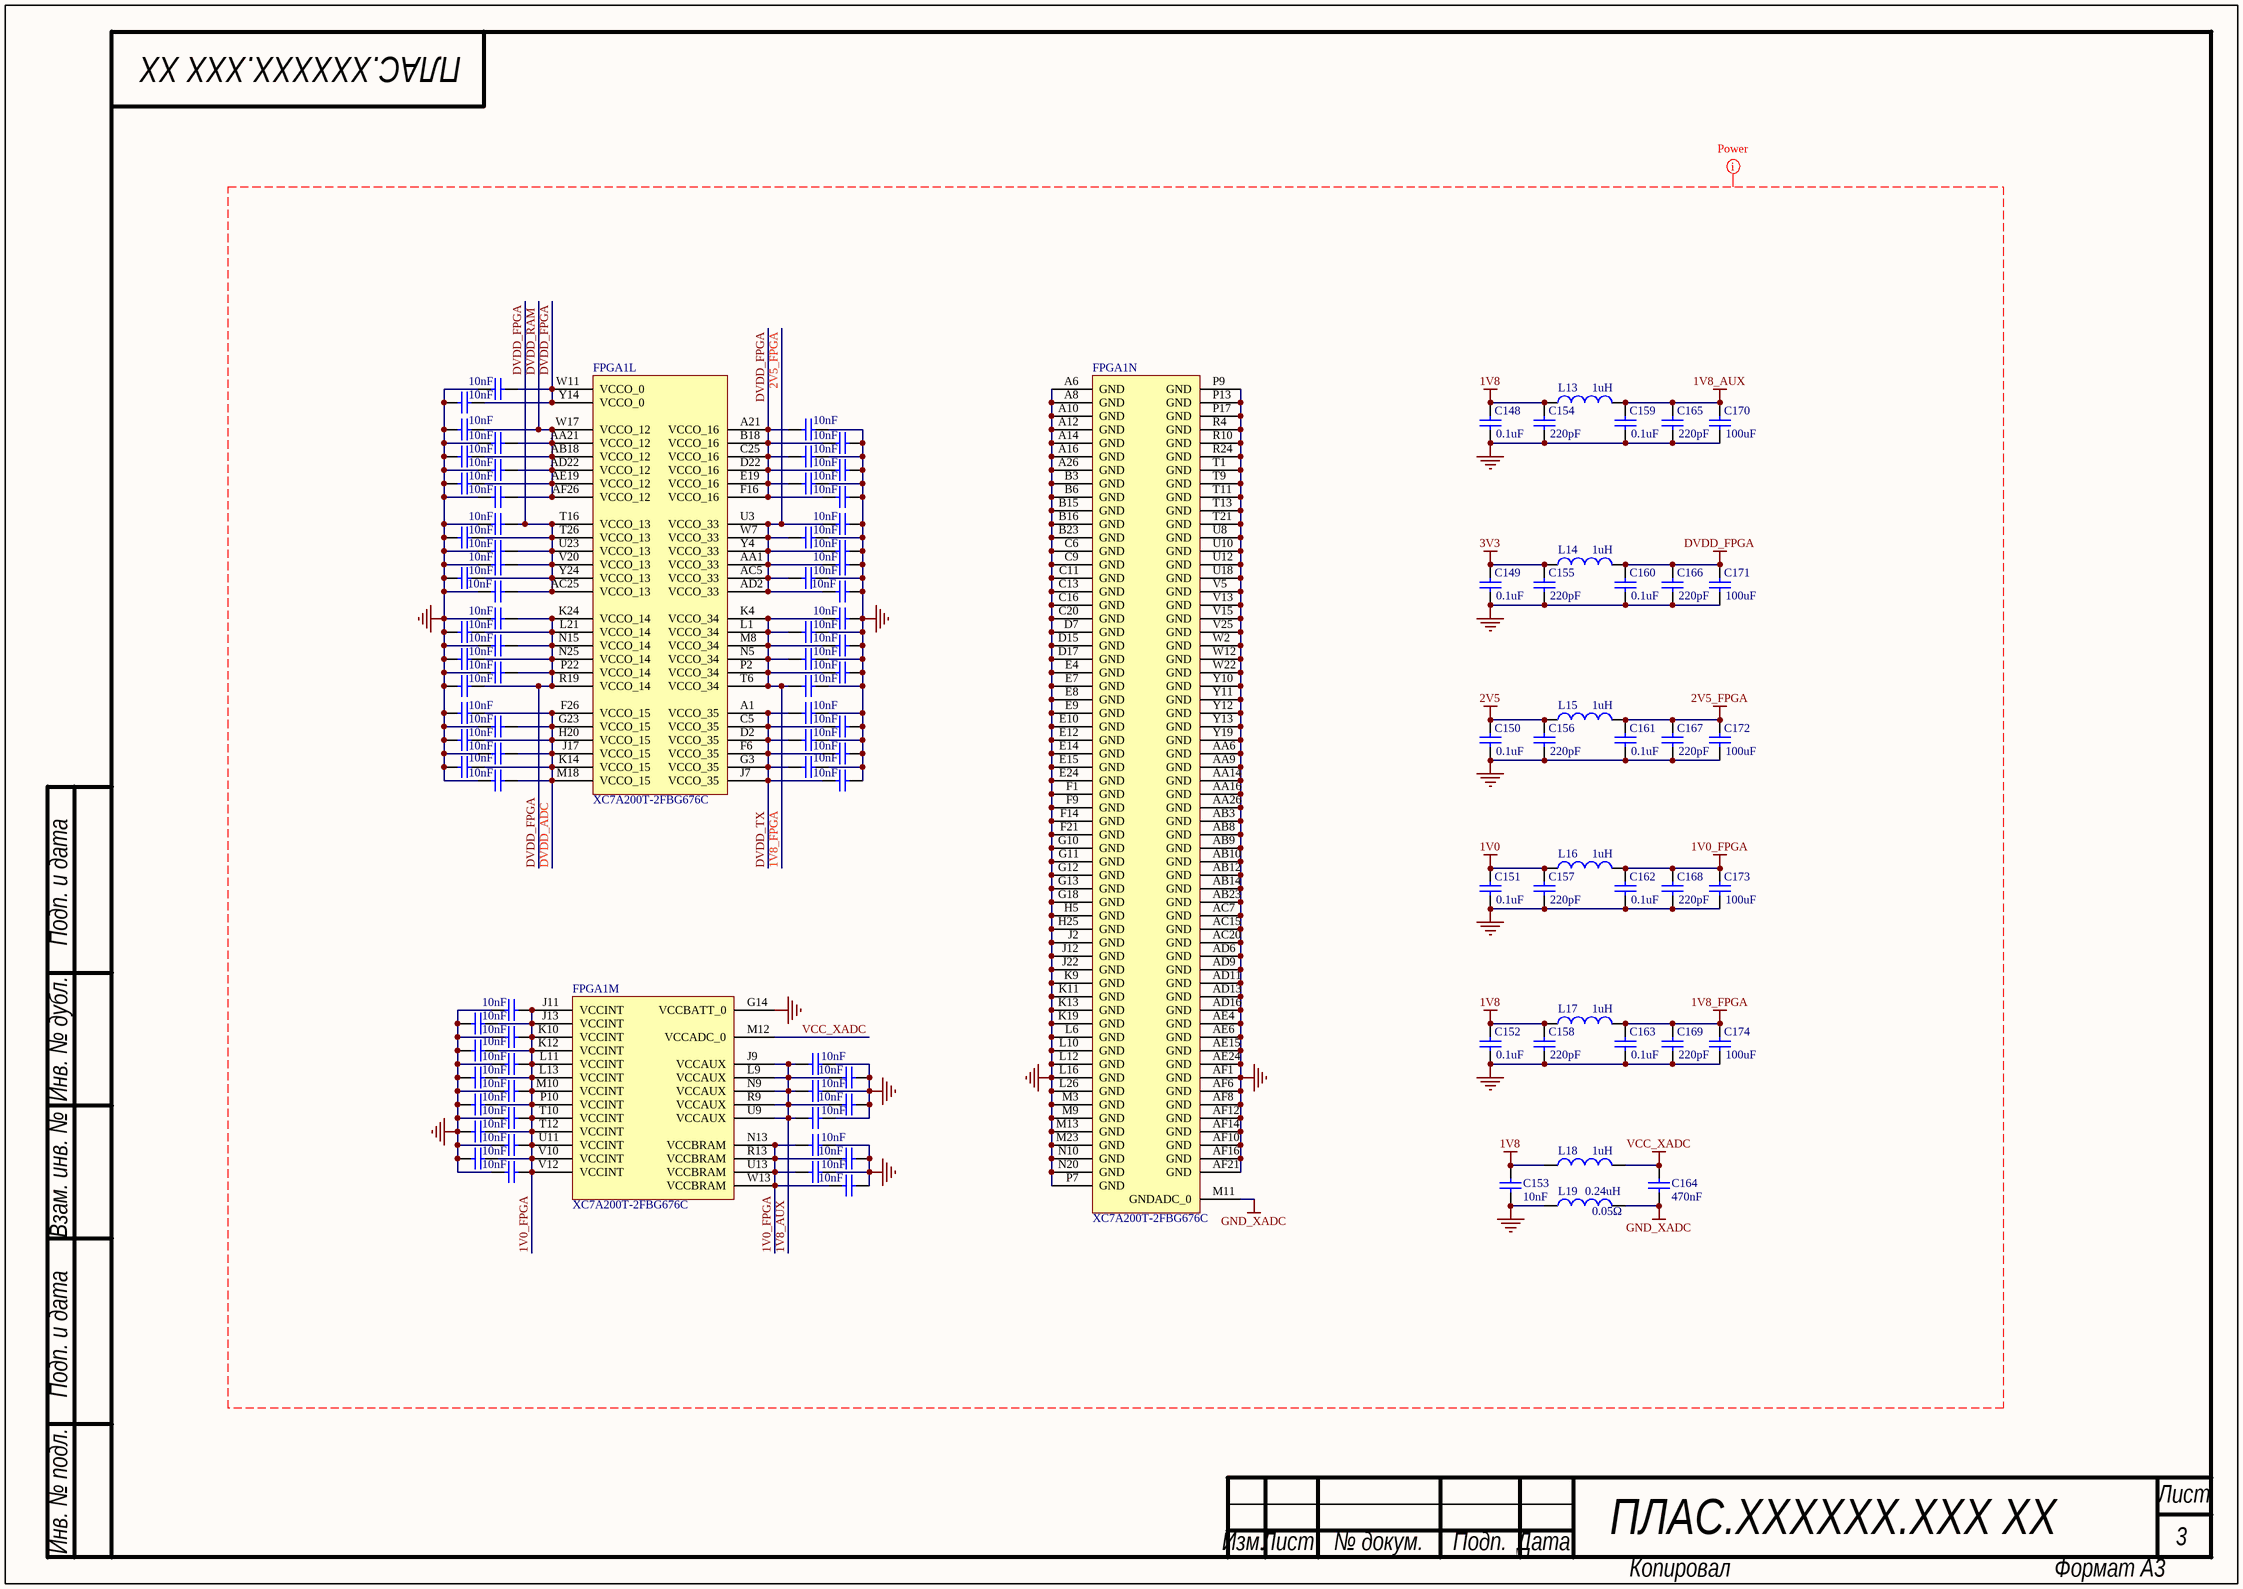
[diagram p2: FPGA_Power.SchDoc]

### Parts
C76  value 10nF  [С0402]  (hidden comment: Cap)
C77  value 10nF  [С0402]  (hidden comment: Cap)
C78  value 10nF  [С0402]  (hidden comment: Cap)
C79  value 10nF  [С0402]  (hidden comment: Cap)
C80  value 10nF  [С0402]  (hidden comment: Cap)
C81  value 10nF  [С0402]  (hidden comment: Cap)
C82  value 10nF  [С0402]  (hidden comment: Cap)
C83  value 10nF  [С0402]  (hidden comment: Cap)
C84  value 10nF  [С0402]  (hidden comment: Cap)
C85  value 10nF  [С0402]  (hidden comment: Cap)
C86  value 10nF  [С0402]  (hidden comment: Cap)
C87  value 10nF  [С0402]  (hidden comment: Cap)
C88  value 10nF  [С0402]  (hidden comment: Cap)
C89  value 10nF  [С0402]  (hidden comment: Cap)
C90  value 10nF  [С0402]  (hidden comment: Cap)
C91  value 10nF  [С0402]  (hidden comment: Cap)
C92  value 10nF  [С0402]  (hidden comment: Cap)
C93  value 10nF  [С0402]  (hidden comment: Cap)
C94  value 10nF  [С0402]  (hidden comment: Cap)
C95  value 10nF  [С0402]  (hidden comment: Cap)
C96  value 10nF  [С0402]  (hidden comment: Cap)
C97  value 10nF  [С0402]  (hidden comment: Cap)
C98  value 10nF  [С0402]  (hidden comment: Cap)
C99  value 10nF  [С0402]  (hidden comment: Cap)
C100  value 10nF  [С0402]  (hidden comment: Cap)
C101  value 10nF  [С0402]  (hidden comment: Cap)
C102  value 10nF  [С0402]  (hidden comment: Cap)
C103  value 10nF  [С0402]  (hidden comment: Cap)
C104  value 10nF  [С0402]  (hidden comment: Cap)
C105  value 10nF  [С0402]  (hidden comment: Cap)
C106  value 10nF  [С0402]  (hidden comment: Cap)
C107  value 10nF  [С0402]  (hidden comment: Cap)
C108  value 10nF  [С0402]  (hidden comment: Cap)
C109  value 10nF  [С0402]  (hidden comment: Cap)
C110  value 10nF  [С0402]  (hidden comment: Cap)
C111  value 10nF  [С0402]  (hidden comment: Cap)
C112  value 10nF  [С0402]  (hidden comment: Cap)
C113  value 10nF  [С0402]  (hidden comment: Cap)
C114  value 10nF  [С0402]  (hidden comment: Cap)
C115  value 10nF  [С0402]  (hidden comment: Cap)
C116  value 10nF  [С0402]  (hidden comment: Cap)
C117  value 10nF  [С0402]  (hidden comment: Cap)
C118  value 10nF  [С0402]  (hidden comment: Cap)
C119  value 10nF  [С0402]  (hidden comment: Cap)
C120  value 10nF  [С0402]  (hidden comment: Cap)
C121  value 10nF  [С0402]  (hidden comment: Cap)
C122  value 10nF  [С0402]  (hidden comment: Cap)
C123  value 10nF  [С0402]  (hidden comment: Cap)
C124  value 10nF  [С0402]  (hidden comment: Cap)
C125  value 10nF  [С0402]  (hidden comment: Cap)
C126  value 10nF  [С0402]  (hidden comment: Cap)
C127  value 10nF  [С0402]  (hidden comment: Cap)
C128  value 10nF  [С0402]  (hidden comment: Cap)
C129  value 10nF  [С0402]  (hidden comment: Cap)
C130  value 10nF  [С0402]  (hidden comment: Cap)
C131  value 10nF  [С0402]  (hidden comment: Cap)
C132  value 10nF  [С0402]  (hidden comment: Cap)
C133  value 10nF  [С0402]  (hidden comment: Cap)
C134  value 10nF  [С0402]  (hidden comment: Cap)
C135  value 10nF  [С0402]  (hidden comment: Cap)
C136  value 10nF  [С0402]  (hidden comment: Cap)
C137  value 10nF  [С0402]  (hidden comment: Cap)
C138  value 10nF  [С0402]  (hidden comment: Cap)
C139  value 10nF  [С0402]  (hidden comment: Cap)
C140  value 10nF  [С0402]  (hidden comment: Cap)
C141  value 10nF  [С0402]  (hidden comment: Cap)
C142  value 10nF  [С0402]  (hidden comment: Cap)
C143  value 10nF  [С0402]  (hidden comment: Cap)
C144  value 10nF  [С0402]  (hidden comment: Cap)
C145  value 10nF  [С0402]  (hidden comment: Cap)
C146  value 10nF  [С0402]  (hidden comment: Cap)
C147  value 10nF  [С0402]  (hidden comment: Cap)
C148  value 0.1uF  [C0603]  (hidden comment: Cap)
C149  value 0.1uF  [C0603]  (hidden comment: Cap)
C150  value 0.1uF  [C0603]  (hidden comment: Cap)
C151  value 0.1uF  [C0603]  (hidden comment: Cap)
C152  value 0.1uF  [C0603]  (hidden comment: Cap)
C153  value 10nF  [С0402]  (hidden comment: Cap)
C154  value 220pF  [C0603]  (hidden comment: Cap)
C155  value 220pF  [C0603]  (hidden comment: Cap)
C156  value 220pF  [C0603]  (hidden comment: Cap)
C157  value 220pF  [C0603]  (hidden comment: Cap)
C158  value 220pF  [C0603]  (hidden comment: Cap)
C159  value 0.1uF  [C0603]  (hidden comment: Cap)
C160  value 0.1uF  [C0603]  (hidden comment: Cap)
C161  value 0.1uF  [C0603]  (hidden comment: Cap)
C162  value 0.1uF  [C0603]  (hidden comment: Cap)
C163  value 0.1uF  [C0603]  (hidden comment: Cap)
C164  value 470nF  [C0603]  (hidden comment: Cap)
C165  value 220pF  [C0603]  (hidden comment: Cap)
C166  value 220pF  [C0603]  (hidden comment: Cap)
C167  value 220pF  [C0603]  (hidden comment: Cap)
C168  value 220pF  [C0603]  (hidden comment: Cap)
C169  value 220pF  [C0603]  (hidden comment: Cap)
C170  value 100uF  [C1210]  (hidden comment: Cap)
C171  value 100uF  [C1210]  (hidden comment: Cap)
C172  value 100uF  [C1210]  (hidden comment: Cap)
C173  value 100uF  [C1210]  (hidden comment: Cap)
C174  value 100uF  [C1210]  (hidden comment: Cap)
FPGA1  XC7A200T-2FBG676C  [FGG676]  (parts L,M,N of 14)
L13  value 1uH  [L1210_Murata LQH]  (hidden comment: Inductor_LF)
L14  value 1uH  [L1210_Murata LQH]  (hidden comment: Inductor_LF)
L15  value 1uH  [L1210_Murata LQH]  (hidden comment: Inductor_LF)
L16  value 1uH  [L1210_Murata LQH]  (hidden comment: Inductor_LF)
L17  value 1uH  [L1210_Murata LQH]  (hidden comment: Inductor_LF)
L18  value 1uH  [L1206_Murata]  (hidden comment: Inductor_LF)
L19  value 0.24uH  DCR: 0.05Ω  [L0805_Murata_LQG]  (hidden comment: Inductor_LF)

### Nets
1V0: C151.1 C157.1 L16.2
1V0_FPGA: C88.1 C89.1 C90.1 C91.1 C92.2 C93.1 C108.2 C109.2 C110.1 C111.2 C112.2 C113.1 C114.1 C129.1 C130.2 C146.2 C147.2 C162.1 C168.1 C173.2 FPGA1.J11(VCCINT) FPGA1.J13(VCCINT) FPGA1.K10(VCCINT) FPGA1.K12(VCCINT) FPGA1.L11(VCCINT) FPGA1.L13(VCCINT) FPGA1.M10(VCCINT) FPGA1.N13(VCCBRAM) FPGA1.P10(VCCINT) FPGA1.R13(VCCBRAM) FPGA1.T10(VCCINT) FPGA1.T12(VCCINT) FPGA1.U11(VCCINT) FPGA1.U13(VCCBRAM) FPGA1.V10(VCCINT) FPGA1.V12(VCCINT) FPGA1.W13(VCCBRAM) L16.1
1V8: C148.1 C152.2 C153.2 C154.1 C158.1 L13.2 L17.2 L18.2
1V8_AUX: C126.1 C127.1 C128.2 C144.1 C145.2 C159.1 C165.1 C170.2 FPGA1.J9(VCCAUX) FPGA1.L9(VCCAUX) FPGA1.N9(VCCAUX) FPGA1.R9(VCCAUX) FPGA1.U9(VCCAUX) L13.1
1V8_FPGA: C120.2 C121.2 C122.2 C138.2 C139.2 C140.2 C163.1 C169.1 C174.1 FPGA1.K4(VCCO_34) FPGA1.L1(VCCO_34) FPGA1.M8(VCCO_34) FPGA1.N5(VCCO_34) FPGA1.P2(VCCO_34) FPGA1.T6(VCCO_34) L17.1
2V5: C150.1 C156.1 L15.2
2V5_FPGA: C118.2 C119.2 C134.2 C135.2 C136.1 C137.2 C161.1 C167.1 C172.2 FPGA1.AA1(VCCO_33) FPGA1.AC5(VCCO_33) FPGA1.AD2(VCCO_33) FPGA1.U3(VCCO_33) FPGA1.W7(VCCO_33) FPGA1.Y4(VCCO_33) L15.1  [project net 2V5_ETH]
3V3: C149.1 C155.1 L14.1
DVDD_ADC: C85.2 C86.2 C87.2 C105.2 C106.2 C107.2 FPGA1.F26(VCCO_15) FPGA1.G23(VCCO_15) FPGA1.H20(VCCO_15) FPGA1.J17(VCCO_15) FPGA1.K14(VCCO_15) FPGA1.M18(VCCO_15)
DVDD_FPGA: C76.2 C80.1 C81.1 C82.1 C83.1 C84.1 C94.2 C98.1 C99.2 C100.1 C101.1 C102.1 C103.1 C104.1 C115.2 C116.2 C117.2 C131.2 C132.2 C133.2 C160.1 C166.1 C171.1 FPGA1.A21(VCCO_16) FPGA1.AC25(VCCO_13) FPGA1.B18(VCCO_16) FPGA1.C25(VCCO_16) FPGA1.D22(VCCO_16) FPGA1.E19(VCCO_16) FPGA1.F16(VCCO_16) FPGA1.K24(VCCO_14) FPGA1.L21(VCCO_14) FPGA1.N15(VCCO_14) FPGA1.N25(VCCO_14) FPGA1.P22(VCCO_14) FPGA1.R19(VCCO_14) FPGA1.T16(VCCO_13) FPGA1.T26(VCCO_13) FPGA1.U23(VCCO_13) FPGA1.V20(VCCO_13) FPGA1.W11(VCCO_0) FPGA1.Y14(VCCO_0) FPGA1.Y24(VCCO_13) L14.2
DVDD_RAM: C77.1 C78.1 C79.1 C95.1 C96.1 C97.1 FPGA1.AA21(VCCO_12) FPGA1.AB18(VCCO_12) FPGA1.AD22(VCCO_12) FPGA1.AE19(VCCO_12) FPGA1.AF26(VCCO_12) FPGA1.W17(VCCO_12)
DVDD_TX: C123.2 C124.2 C125.2 C141.2 C142.2 C143.2 FPGA1.A1(VCCO_35) FPGA1.C5(VCCO_35) FPGA1.D2(VCCO_35) FPGA1.F6(VCCO_35) FPGA1.G3(VCCO_35) FPGA1.J7(VCCO_35)
GND: C76.1 C77.2 C78.2 C79.2 C80.2 C81.2 C82.2 C83.2 C84.2 C85.1 C86.1 C87.1 C88.2 C89.2 C90.2 C91.2 C92.1 C93.2 C94.1 C95.2 C96.2 C97.2 C98.2 C99.1 C100.2 C101.2 C102.2 C103.2 C104.2 C105.1 C106.1 C107.1 C108.1 C109.1 C110.2 C111.1 C112.1 C113.2 C114.2 C115.1 C116.1 C117.1 C118.1 C119.1 C120.1 C121.1 C122.1 C123.1 C124.1 C125.1 C126.2 C127.2 C128.1 C129.2 C130.1 C131.1 C132.1 C133.1 C134.1 C135.1 C136.2 C137.1 C138.1 C139.1 C140.1 C141.1 C142.1 C143.1 C144.2 C145.1 C146.1 C147.1 C148.2 C149.2 C150.2 C151.2 C152.1 C153.1 C154.2 C155.2 C156.2 C157.2 C158.2 C159.2 C160.2 C161.2 C162.2 C163.2 C165.2 C166.2 C167.2 C168.2 C169.2 C170.1 C171.2 C172.1 C173.1 C174.2 FPGA1.A6(GND) FPGA1.A8(GND) FPGA1.A10(GND) FPGA1.A12(GND) FPGA1.A14(GND) FPGA1.A16(GND) FPGA1.A26(GND) FPGA1.AA6(GND) FPGA1.AA9(GND) FPGA1.AA14(GND) FPGA1.AA16(GND) FPGA1.AA26(GND) FPGA1.AB3(GND) FPGA1.AB8(GND) FPGA1.AB9(GND) FPGA1.AB10(GND) FPGA1.AB12(GND) FPGA1.AB14(GND) FPGA1.AB23(GND) FPGA1.AC7(GND) FPGA1.AC15(GND) FPGA1.AC20(GND) FPGA1.AD6(GND) FPGA1.AD9(GND) FPGA1.AD11(GND) FPGA1.AD13(GND) FPGA1.AD16(GND) FPGA1.AE4(GND) FPGA1.AE6(GND) FPGA1.AE15(GND) FPGA1.AE24(GND) FPGA1.AF1(GND) FPGA1.AF6(GND) FPGA1.AF8(GND) FPGA1.AF10(GND) FPGA1.AF12(GND) FPGA1.AF14(GND) FPGA1.AF16(GND) FPGA1.AF21(GND) FPGA1.B3(GND) FPGA1.B6(GND) FPGA1.B15(GND) FPGA1.B16(GND) FPGA1.B23(GND) FPGA1.C6(GND) FPGA1.C9(GND) FPGA1.C11(GND) FPGA1.C13(GND) FPGA1.C16(GND) FPGA1.C20(GND) FPGA1.D7(GND) FPGA1.D15(GND) FPGA1.D17(GND) FPGA1.E4(GND) FPGA1.E7(GND) FPGA1.E8(GND) FPGA1.E9(GND) FPGA1.E10(GND) FPGA1.E12(GND) FPGA1.E14(GND) FPGA1.E15(GND) FPGA1.E24(GND) FPGA1.F1(GND) FPGA1.F9(GND) FPGA1.F14(GND) FPGA1.F21(GND) FPGA1.G10(GND) FPGA1.G11(GND) FPGA1.G12(GND) FPGA1.G13(GND) FPGA1.G14(VCCBATT_0) FPGA1.G18(GND) FPGA1.H5(GND) FPGA1.H25(GND) FPGA1.J2(GND) FPGA1.J12(GND) FPGA1.J22(GND) FPGA1.K9(GND) FPGA1.K11(GND) FPGA1.K13(GND) FPGA1.K19(GND) FPGA1.L6(GND) FPGA1.L10(GND) FPGA1.L12(GND) FPGA1.L16(GND) FPGA1.L26(GND) FPGA1.M3(GND) FPGA1.M9(GND) FPGA1.M13(GND) FPGA1.M23(GND) FPGA1.N10(GND) FPGA1.N20(GND) FPGA1.P7(GND) FPGA1.P9(GND) FPGA1.P13(GND) FPGA1.P17(GND) FPGA1.R4(GND) FPGA1.R10(GND) FPGA1.R24(GND) FPGA1.T1(GND) FPGA1.T9(GND) FPGA1.T11(GND) FPGA1.T13(GND) FPGA1.T21(GND) FPGA1.U8(GND) FPGA1.U10(GND) FPGA1.U12(GND) FPGA1.U18(GND) FPGA1.V5(GND) FPGA1.V13(GND) FPGA1.V15(GND) FPGA1.V25(GND) FPGA1.W2(GND) FPGA1.W12(GND) FPGA1.W22(GND) FPGA1.Y10(GND) FPGA1.Y11(GND) FPGA1.Y12(GND) FPGA1.Y13(GND) FPGA1.Y19(GND) L19.1
GND_XADC: C164.2 FPGA1.M11(GNDADC_0) L19.2
VCC_XADC: C164.1 FPGA1.M12(VCCADC_0) L18.1

### Layout directives
net class Power: 1V0, 1V0_FPGA, 1V8, 1V8_AUX, 1V8_FPGA, 2V5, 2V5_FPGA, 3V3, DVDD_ADC, DVDD_FPGA, DVDD_RAM, DVDD_TX, GND, GND_XADC, VCC_XADC

### Notes on the sheet
- Подп. и дата
- Инв. № дубл.
- Взам. инв. №
- Инв. № подл.
- Лист
- Изм.
- № докум.
- Подп.
- Дата
- Копировал
- Формат А3

### Library data of the parts
C76-C147 C153 = Cer Cap: as C15 on sheet Power_Supply; PackageReference: SMD Chip Capacitor; Package: 0402
C148-C152 C154-C163 C165-C169 = Cer Cap: as C3 on sheet Power_Supply; PackageReference: SMD Chip Capacitor; Package: 0603
C164 = Cer Cap: as C9 on sheet Power_Supply; PackageReference: SMD Chip Capacitor; Package: 0603
C170-C174 = Cap uF: as C6 on sheet Power_Supply; Package: C1210; PackageDescription: SMD Chip Capacitor
FPGA1 = XC7A200T-2FBG676C: Artix-7 FPGA, 400 User I/Os, 8 GTP, 676-Ball BGA, Speed Grade 2, Commercial Grade, Pb-Free; Manufacturer: Xilinx; Block RAM Blocks (18Kb): 730; Block RAM Blocks (36Kb): 365; Block RAM Blocks (Max Kb): 13140; CLBs (Slices): 33650; Clock Mgmt Tiles (CMTs): 10; DSP48E1 Slices: 740; Logic Cells: 215360; Max User I/O: 500; Speed Grade: -2; DatasheetVersion: v1.12; PackageVersion: Rev 1.8; PackageReference: FBG676; PackageDescription: Flip-Chip Lidless BGA, Body 27 x 27 mm, 1.0 mm Pitch; Supplier 1: Digi-Key; Supplier Part Number 1: 122-1865-ND; CLBs (Max Distributed RAM Kb): 2888; Generic Part Number: XC7A200T; RoHS: Pb-Free; NexusDeviceID: XC7A200T-2FBG676C; Mounting Technology: Surface Mount; Code_JEDEC: MS-034; PartNumber: XC7A200T-2FBG676C; ComponentLink1Description: Manufacturer URL; ComponentLink1URL: http://www.xilinx.com/; ComponentLink2Description: Datasheet; ComponentLink2URL: http://www.xilinx.com/support/documentation/data_sheets/ds180_7Series_Overview.pdf; ComponentLink3Description: Package Specification; ComponentLink3URL: http://www.xilinx.com/support/documentation/user_guides/ug475_7Series_Pkg_Pinout.pdf; ComponentLink4Description: DC and Switching Characteristics; ComponentLink4URL: http://www.xilinx.com/support/documentation/data_sheets/ds181_Artix_7_Data_Sheet.pdf; ComponentLink5Description: Package File; ComponentLink5URL: http://www.xilinx.com/support/packagefiles/a7packages/xc7a200tfbg676pkg.txt; ComponentLink6Description: Packaging and Pinout; ComponentLink6URL: http://www.xilinx.com/support/documentation/user_guides/ug475_7Series_Pkg_Pinout.pdf
L13-L17 = Inductor_LF: as L7 on sheet MGT_PWR; Package: 1210; PackageDescription: Chip Inductor; Temperature Range: -25…85; Series: LQH
L18 = Inductor_LF: Inductor_Power_Lines; Manufacturer: Murata; Name: LQM31PN1R0M00; Tolerance: 5%; Current: 1200mA; Frequency: 60MHz; Package: 1206; PackageDescription: Chip Inductor; Temperature Range: -25…85; Series: LQM
L19 = Inductor_LF: Inductor_Power_Lines; Manufacturer: Murata; Name: LQM21PNR24MEH; Tolerance: ±20%; Current: 2.4A; Frequency: 130MHz; Package: 0805; PackageDescription: Chip Inductor; Temperature Range: -25…85; Series: LQM